# Altium schematic sheet 1_P1.schdoc
size 307 x 218 mm; Symbol: Sheet-Symbol_A4; Device: Sheet-Symbol_A4; Company: 嘉立创EDA; Drawed: H.; Version: V1.0; Page Size: A4; @Project Name: 无线充接收底座; @Page Count: 1; @Update Date: 2025-08-01; @Create Date: 2025-08-01; @Schematic Name: Schematic1; @Page No: 1; @Page Name: P1; Title Block Position: 3; Width: 1170; Height: 825; Region Start: 1; X Region Count: 6; Y Region Count: 4; Blade Width: 10; @Board Name: Board1; @Create Time: 10:22:18; @Update Time: 10:22:18
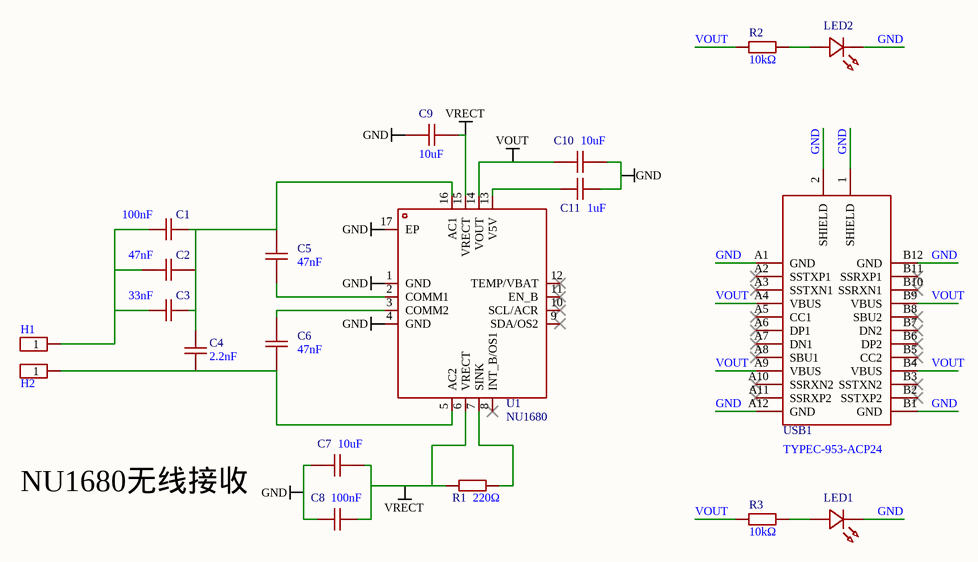
[diagram p0: 1_P1.schdoc]

## Parts
C1  100nF  [C0603]
C2  47nF  [C0603]
C3  33nF  [C0603]
C4  2.2nF  [C0603]
C5  47nF  [C0603]
C6  47nF  [C0603]
C7  10uF  [C0603]
C8  100nF  [C0603]
C9  10uF  [C0603]
C10  10uF  [C0603]
C11  1uF  [C0603]
H1  2.54-1*1P针  [2mm-1.3mm孔]  (value not drawn)
H2  2.54-1*1P针  [2mm-1.3mm孔]  (value not drawn)
LED1  MHT192DUGCT  [LED0603-RD]  (value not drawn)
LED2  MHT192DUGCT  [LED0603-RD]  (value not drawn)
R1  220Ω  [R0805]
R2  10kΩ  [R0603]
R3  10kΩ  [R0603]
U1  NU1680  [QFN-16_L3.0-W3.0-P0.50-TL-EP1.9]
USB1  TYPEC-953-ACP24  [USB-C-SMD_TYPEC-953-ACP24]

## Nets
GND: C7.1 C8.1 C9.1 C10.2 C11.2 LED1.1(K) LED2.1(K) U1.1(GND) U1.4(GND) U1.17(EP) USB1.1(SHIELD) USB1.2(SHIELD) USB1.A1(GND) USB1.A12(GND) USB1.B1(GND) USB1.B12(GND)
VOUT: C10.1 R2.1 R3.1 U1.14(VOUT) USB1.A4(VBUS) USB1.A9(VBUS) USB1.B4(VBUS) USB1.B9(VBUS)
VRECT: C7.2 C8.2 C9.2 R1.1 U1.6(VRECT) U1.15(VRECT)
NetC1_1: C1.1 C2.2 C3.1 H1.1
NetC1_2: C1.2 C2.1 C3.2 C4.2 C5.1 U1.16(AC1)
NetC4_1: C4.1 C6.2 H2.1 U1.5(AC2)
NetC5_2: C5.2 U1.2(COMM1)
NetC6_1: C6.1 U1.3(COMM2)
NetC11_1: C11.1 U1.13(V5V)
NetLED1_2: LED1.2(A) R3.2
NetLED2_2: LED2.2(A) R2.2
NetR1_2: R1.2 U1.7(SINK)

Not connected (* = marked no-connect by the designer): U1 8(INT_B/OS1)* 9(SDA/OS2)* 10(SCL/ACR)* 11(EN_B)* 12(TEMP/VBAT)*; USB1 A2(SSTXP1)* A3(SSTXN1)* A5(CC1)* A6(DP1)* A7(DN1)* A8(SBU1)* A10(SSRXN2)* A11(SSRXP2)* B2(SSTXP2)* B3(SSTXN2)* B5(CC2)* B6(DP2)* B7(DN2)* B8(SBU2)* B10(SSRXN1)* B11(SSRXP1)*

## Notes on the sheet
- NU1680无线接收
- 1
- 2
- 3
- 4
- 5
- 6
- A
- B
- C
- 原理图
- Schematic1
- 创建日期
- 更新日期
- 2025-08-01
- 绘制
- 图页
- H.
- P1
- 物料编码
- D
- 审阅
- 版本
- 尺寸
- 无线充接收底座
- 页
- 共
- V1.0
- A4
- 嘉立创EDA

## Library data of the parts
C1 C8 = 0603B104K500NT: Manufacturer: FH(风华); Add into BOM: yes; Tolerance: ±10%; Voltage Rated: 50V; Temperature Coefficient: X7R; Symbol: 0603B104K500NT; Device: 0603B104K500NT; Supplier: LCSC; Manufacturer Part: 0603B104K500NT; Value: 100nF; Supplier Part: C30926; JLCPCB Part Class: 扩展库; LCSC Part Name: 100nF ±10% 50V; Supplier Footprint: 0603; Datasheet: https://atta.szlcsc.com/upload/public/pdf/source/20200305/C486355_26A10D38EF8C2A5C37091D0039909270.pdf; Convert to PCB: yes
C2 C5 C6 = 0603B473K500NT: Manufacturer: FH(风华); Add into BOM: yes; Tolerance: ±10%; Voltage Rated: 50V; Temperature Coefficient: X7R; Symbol: 0603B473K500NT; Device: 0603B473K500NT; LCSC Part Name: 47nF ±10% 50V; Supplier Part: C285123; Manufacturer Part: 0603B473K500NT; Supplier Footprint: 0603; JLCPCB Part Class: Extended Part; Datasheet: https://atta.szlcsc.com/upload/public/pdf/source/20200305/C486355_26A10D38EF8C2A5C37091D0039909270.pdf; Supplier: LCSC; Convert to PCB: yes; Value: 47nF
C3 = CL10B333KB8NNNC: Manufacturer: SAMSUNG(三星); Add into BOM: yes; Tolerance: ±10%; Voltage Rated: 50V; Temperature Coefficient: X7R; Symbol: CL10B333KB8NNNC; Device: CL10B333KB8NNNC; LCSC Part Name: 33nF ±10% 50V; Supplier Part: C21117; Manufacturer Part: CL10B333KB8NNNC; Supplier Footprint: 0603; JLCPCB Part Class: 基础库; Datasheet: https://atta.szlcsc.com/upload/public/pdf/source/20160218/1457707763339.pdf; Supplier: LCSC; Convert to PCB: yes; Value: 33nF
C4 = 0603B222K500NT: Manufacturer: FH(风华); Add into BOM: yes; Tolerance: ±10%; Voltage Rated: 50V; Temperature Coefficient: X7R; Symbol: 0603B222K500NT; Device: 0603B222K500NT; LCSC Part Name: 2.2nF ±10% 50V; Supplier Part: C1604; Manufacturer Part: 0603B222K500NT; Supplier Footprint: 0603; JLCPCB Part Class: Basic Part; Datasheet: https://atta.szlcsc.com/upload/public/pdf/source/20200305/C486355_26A10D38EF8C2A5C37091D0039909270.pdf; Supplier: LCSC; Convert to PCB: yes; Value: 2.2nF
C7 C9 C10 = CL10A106MA8NRNC: Manufacturer: SAMSUNG(三星); Add into BOM: yes; Tolerance: ±20%; Voltage Rated: 25V; Temperature Coefficient: X5R; Symbol: CL10A106MA8NRNC; Device: CL10A106MA8NRNC; Supplier: LCSC; Manufacturer Part: CL10A106MA8NRNC; Value: 10uF; Supplier Part: C96446; JLCPCB Part Class: 基础库; LCSC Part Name: 10uF ±20% 25V; Supplier Footprint: 0603; Datasheet: https://atta.szlcsc.com/upload/public/pdf/source/20160218/1457707763339.pdf; Convert to PCB: yes
C11 = CL10A105KB8NNNC: Manufacturer: SAMSUNG(三星); Add into BOM: yes; Tolerance: ±10%; Voltage Rated: 50V; Temperature Coefficient: X5R; Symbol: CL10A105KB8NNNC; Device: CL10A105KB8NNNC; Supplier: LCSC; Manufacturer Part: CL10A105KB8NNNC; Value: 1uF; Supplier Part: C15849; JLCPCB Part Class: Basic Part; LCSC Part Name: 1uF ±10% 50V; Supplier Footprint: 0603; Datasheet: https://atta.szlcsc.com/upload/public/pdf/source/20160218/1457707763339.pdf; Convert to PCB: yes
H1 H2 = 2.54-1*1P针: Manufacturer: BOOMELE(博穆精密); Symbol: hdr_1x1; Add into BOM: no; Convert to PCB: yes; Device: 2.54-1*1P针; LCSC Part Name: 直插; Supplier Part: C81276; Manufacturer Part: 2.54-1*1P针; Supplier Footprint: 插件,P=2.54mm; JLCPCB Part Class: Extended Part; Datasheet: https://atta.szlcsc.com/upload/public/pdf/source/20221018/3E9408392E35E6F57A28985E5F7BF5C9.pdf; Supplier: LCSC; Number of Rows: 单排; Number of Pins: 1P; Pitch: -; Pin Structure: -; Row Spacing: -; Mounting Type: 直插; Circluar Pins/Square Pins: -; Current Rating (Max): -; Voltage Rating (Max): -; Length of Mating Pin: -; Insulation Height: -; Contact Material: -; Contact Plating: -; Color: 黑色
LED1 LED2 = MHT192DUGCT: Manufacturer: MEIHUA(美华); Add into BOM: yes; Emitted Color: 翠绿色; Forward Voltage (VF): 2.3V~2.8V; Forward Current: 5mA; Dominant Wavelength: 515nm~530nm; Peak Wavelength: 518nm; Lens Color: 透明透镜; Luminous Intensity: 285mcd~565mcd; Viewing Angle: 120°; Symbol: MHT192DUGCT; Device: MHT192DUGCT; LCSC Part Name: 0603正贴翠绿色光0.6T; Supplier Part: C7470862; Manufacturer Part: MHT192DUGCT; Supplier Footprint: 0603; JLCPCB Part Class: 扩展库; Datasheet: https://atta.szlcsc.com/upload/public/pdf/source/20231114/40E469906A7C8BE4964C1CB3B5553F65.pdf; Supplier: LCSC; Convert to PCB: yes; Operating Temperature: -40℃~+85℃
R1 = 0805W8J0221T5E: Manufacturer: UNI-ROYAL(厚声); Add into BOM: yes; Tolerance: ±5%; Power(Watts): 125mW; Overload Voltage (Max): 150V; Temperature Coefficient: ±100ppm/℃; Symbol: 0805W8J0221T5E; Device: 0805W8J0221T5E; Supplier: LCSC; Manufacturer Part: 0805W8J0221T5E; Supplier Part: C25294; Value: 220Ω; JLCPCB Part Class: 扩展库; LCSC Part Name: 220Ω ±5% 125mW 厚膜电阻; Supplier Footprint: 0805; Datasheet: https://atta.szlcsc.com/upload/public/pdf/source/20200306/C422600_1E6D84923E4A46A82E41ADD87F860B5C.pdf; Convert to PCB: yes; Type: 厚膜电阻; Operating Temperature Range: -55℃~+155℃
R2 R3 = 0603WAF1002T5E: Manufacturer: UNI-ROYAL(厚声); Add into BOM: yes; Tolerance: ±1%; Power(Watts): 100mW; Voltage-Supply(Max): 75V; Temperature Coefficient: ±100ppm/℃; Symbol: 0603WAF1002T5E; Device: 0603WAF1002T5E; LCSC Part Name: 厚膜电阻 10kΩ ±1% 100mW; Supplier Part: C25804; Manufacturer Part: 0603WAF1002T5E; Supplier Footprint: 0603; JLCPCB Part Class: 基础库; Datasheet: https://atta.szlcsc.com/upload/public/pdf/source/20200306/C422600_1E6D84923E4A46A82E41ADD87F860B5C.pdf; Supplier: LCSC; Convert to PCB: yes; Type: 厚膜电阻; Value: 10kΩ; Operating Temperature: -55℃~+155℃
U1 = NU1680: Add into BOM: yes; Symbol: NU1680; Device: NU1680; LCSC Part Name: NU1680; Supplier Part: C9900015597; Manufacturer Part: NU1680; Supplier Footprint: QFN-16; JLCPCB Part Class: 扩展库; Datasheet: https://atta.szlcsc.comnull; Supplier: LCSC; Convert to PCB: yes
USB1 = TYPEC-953-ACP24: Manufacturer: XUNPU(讯普); Add into BOM: yes; Connector Type: Type-C; Gender: 公; Number of Ports: 1; Number of Contacts: 24P; Current Rating - Power (Max): 5A; Soldering Temperature(Max): 260℃; Symbol: TYPEC-953-ACP24; Device: TYPEC-953-ACP24; LCSC Part Name: Type-C 公 立贴; Supplier Part: C2840397; Manufacturer Part: TYPEC-953-ACP24; Supplier Footprint: SMD; JLCPCB Part Class: 扩展库; Datasheet: https://atta.szlcsc.com/upload/public/pdf/source/20210712/C2840397_F12B7D151AA3FDBE55F61123537BD469.pdf; Supplier: LCSC; Convert to PCB: yes; Standard: USB 3.1; Mounting Style: 立贴; Operating Temperature Range: -25℃~+85℃